# EAGLE schematic cap_meter (EAGLE 9.3.0)
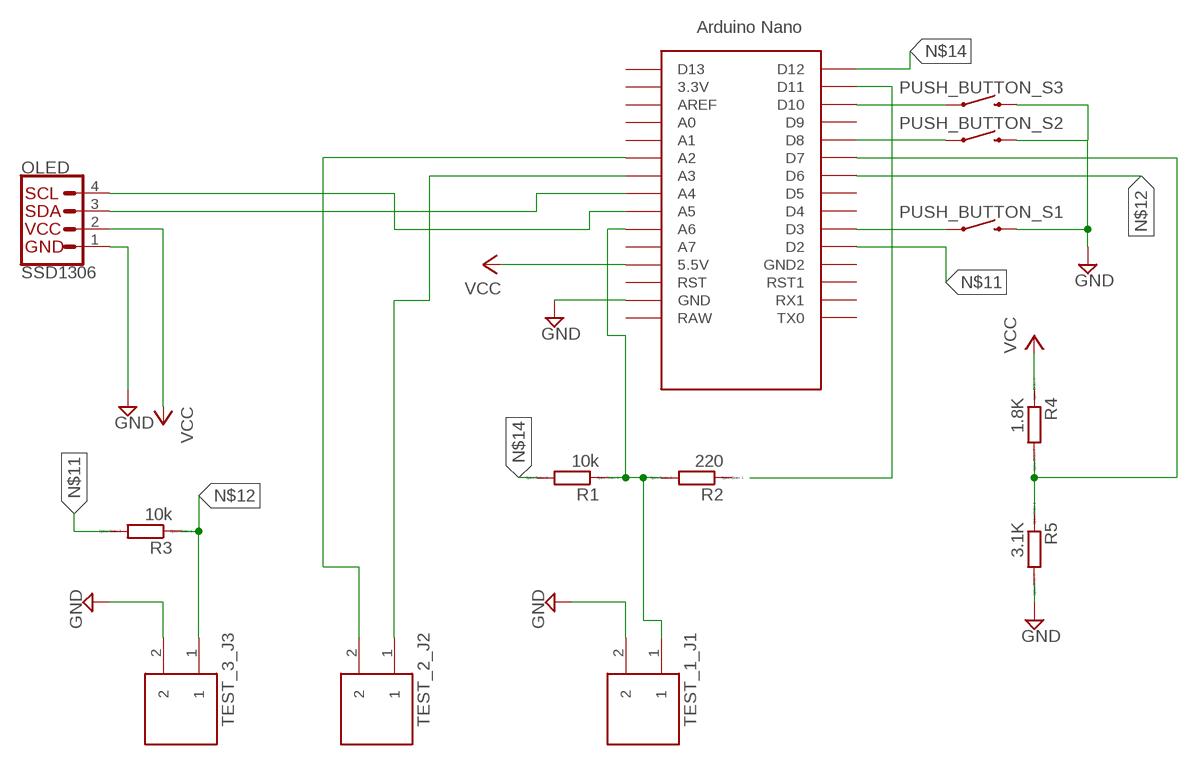
[diagram p0: schematic, sheet 1]

## Parts
OLED  SSD1306  I2C_STANDARD  [1X04]
PUSH_BUTTON_S1  MOMENTARY-SWITCH-SPST-PTH-6.0MM-KIT  [TACTILE_SWITCH_PTH_6.0MM_KIT]
PUSH_BUTTON_S2  MOMENTARY-SWITCH-SPST-PTH-6.0MM-KIT  [TACTILE_SWITCH_PTH_6.0MM_KIT]
PUSH_BUTTON_S3  MOMENTARY-SWITCH-SPST-PTH-6.0MM-KIT  [TACTILE_SWITCH_PTH_6.0MM_KIT]
R1  10k  RR1210  [R1210]
R2  220  RR1210  [R1210]
R3  10k  RR1210  [R1210]
R4  1.8K  RR1210  [R1210]
R5  3.1K  RR1210  [R1210]
TEST_1_J1  ED555/2DS  [ED555/2DS]
TEST_2_J2  ED555/2DS  [ED555/2DS]
TEST_3_J3  ED555/2DS  [ED555/2DS]
U$1  NANO  [NANO]

## Nets
GND: OLED.1 PUSH_BUTTON_S1.3 PUSH_BUTTON_S2.3 PUSH_BUTTON_S3.3 R5.2 TEST_1_J1.2 TEST_3_J3.2 U$1.GND
N$1: OLED.3 U$1.A4
N$2: OLED.4 U$1.A5
N$3: TEST_2_J2.1 U$1.A3
N$4: PUSH_BUTTON_S2.1 U$1.D8
N$5: TEST_2_J2.2 U$1.A2
N$6: PUSH_BUTTON_S1.1 U$1.D3
N$7: U$1.D11
N$8: R1.1 R2.2 TEST_1_J1.1 U$1.A6
N$10: PUSH_BUTTON_S3.1 U$1.D10
N$11: R3.2 U$1.D2
N$12: R3.1 TEST_3_J3.1 U$1.D6
N$13: R4.2 R5.1 U$1.D7
N$14: R1.2 U$1.D12
VCC: OLED.2 R4.1 U$1.5V(5.5V)
Unconnected: R2.1 U$1.3.3V U$1.A0 U$1.A1 U$1.A7 U$1.AREF U$1.D4 U$1.D5 U$1.D9 U$1.D13 U$1.GND1(GND2) U$1.ICSP1 U$1.ICSP2 U$1.ICSP3 U$1.ICSP4 U$1.ICSP5 U$1.ICSP6 U$1.RAW U$1.RST U$1.RST1 U$1.RX1 U$1.TX0

## Library data of the parts
OLED = SparkFun-Connectors:I2C_STANDARD: SparkFun I2C Standard Pinout Header SparkFun has standardized on a pinout for all I2C based sensor breakouts. This pinout allows I2C boards to be plugged directly into the headers on Arduino Uno compatible boards, and to be daisy chained easily. Example SparkFun Products: SparkFun Atmospheric Sensor Breakout - BME280 <https://www.sparkfun.com/products/13676> SparkFun Altitude/Pressure Sensor Breakout - MPL3115A2 <https://www.sparkfun.com/products/11084> SparkFun TOF Range Finder Sensor - VL6180 <https://www.sparkfun.com/products/12785>
PUSH_BUTTON_S1-PUSH_BUTTON_S3 = SparkFun-Switches:MOMENTARY-SWITCH-SPST: Momentary Switch (Pushbutton) - SPST Normally-open (NO) SPST momentary switches (buttons, pushbuttons). Variants PTH-12MM - 12mm square, through-hole Momentary Pushbutton Switch - 12mm Square <https://www.sparkfun.com/products/9190> (COM-09190) PTH-6.0MM, PTH-6.0MM-KIT - 6.0mm square, through-hole Mini Pushbutton Switch <https://www.sparkfun.com/products/97> (COM-00097) KIT package intended for soldering kit's - only one side of pads' copper is exposed. PTH-RIGHT-ANGLE-KIT - Right-angle, through-hole Right Angle Tactile Button <https://www.sparkfun.com/products/10791> - Used on SparkFun BigTime Watch Kit <https://www.sparkfun.com/products/11734> SMD-12MM - 12mm square, surface-mount Tactile Button - SMD (12mm) <https://www.sparkfun.com/products/12993> (COM-12993) Used on SparkFun PicoBoard <https://www.sparkfun.com/products/11888> SMD-4.5MM - 4.5mm Square Trackball Switch Used on SparkFun Blackberry Trackballer Breakout <https://www.sparkfun.com/products/13169> SMD-4.6MMX2.8MM - 4.60mm x 2.80mm, surface mount Used on SparkFun SAMD21 Mini Breakout <https://www.sparkfun.com/products/13664> SMD-5.2MM, SMD-5.2-REDUNDANT - 5.2mm square, surface-mount Mini Pushbutton Switch - SMD <https://www.sparkfun.com/products/8720> (COM-08720) Used on Arduino Pro Mini <https://www.sparkfun.com/products/11114> REDUNDANT package connects both switch circuits together SMD-6.0X3.5MM - 6.0 x 3.5mm, surface mount Momentary Reset Switch SMD <https://www.sparkfun.com/products/8229> (COM-08229) SMD-6.2MM-TALL - 6.2mm square, surface mount Tactile Button - SMD (6mm) <https://www.sparkfun.com/products/12992> Used on SparkFun Digital Sandbox <https://www.sparkfun.com/products/12651> SMD-RIGHT-ANGLE - Right-angle, surface mount Used on SparkFun Block for Intel® Edison - Arduino <https://www.sparkfun.com/products/13036>; PROD_ID: SWCH-08441; SF_SKU: COM-00097
R1-R5 = eagle-ltspice:R: RESISTOR, European symbol; SPICEMODEL: NONE; SPICEPREFIX: R
TEST_1_J1 TEST_2_J2 TEST_3_J3 = DC_LOAD_AU:ED555/2DS: 2-Pin Terminal Block 3.5mm pitch 6A
U$1 = Arduino-clone:NANO: Arduino Nano